# Altium schematic sheet ADXL345.SchDoc
size A; SheetNumber: 3; SheetTotal: 6
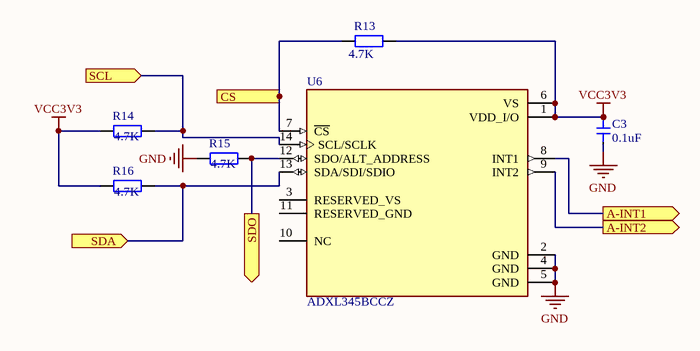
[diagram p0: ADXL345.SchDoc]

## Parts
C3  0.1uF  [Cap 0805]
R13  4.7K  [tro smd 0805]
R14  4.7K  [tro smd 0805]
R15  4.7K  [tro smd 0805]
R16  4.7K  [tro smd 0805]
U6  ADXL345BCCZ  [IC_ADXL345BCCZ]

## Ports
A-INT1 (out), A-INT2 (out), CS (in), SCL (in), SDA (in), SDO (out)

## Nets
GND: C3.2 R15.2 U6.2(GND) U6.4(GND) U6.5(GND)
VCC3V3: C3.1 R13.1 R14.2 R16.2 U6.1(VDD_I/O) U6.6(VS)
A-INT1: U6.8(INT1) ; port A-INT1
A-INT2: U6.9(INT2) ; port A-INT2
CS: R13.2 U6.7(~{CS}) ; port CS
SCL: R14.1 U6.14(SCL/SCLK) ; port SCL
SDA: R16.1 U6.13(SDA/SDI/SDIO) ; port SDA
SDO: R15.1 U6.12(SDO/ALT_ADDRESS) ; port SDO

Not connected (* = marked no-connect by the designer): U6 3(RESERVED_VS) 10(NC) 11(RESERVED_GND)

## Library data of the parts
C3 = Cap 0805: Capacitor SMD 0805
R13-R16 = Tro 0805 1% 0.5R: Dán; Don_Vi: Con; So_Chan: 2; Ten_Linh_Kien: Trở 0805 1% 0.5R; Ma_Hang: MH005465; Chung_Loai: Dán; Kieu_Chan: *
U6 = ADXL345BCCZ: 3-Axis, Â±2 g/Â±4 g/Â±8 g/Â±16 g Digital Accelerometer; MF: Analog Devices; SnapEDA_Link: https://www.snapeda.com/parts/ADXL345BCCZ/Analog+Devices/view-part/?ref=snap; Package: LGA -14 Analog Devices; Value: *; MP: ADXL345BCCZ; Check_prices: https://www.snapeda.com/parts/ADXL345BCCZ/Analog+Devices/view-part/?ref=eda